# EAGLE design grab (EAGLE 6.6.0)

## Sheet 1 of 5
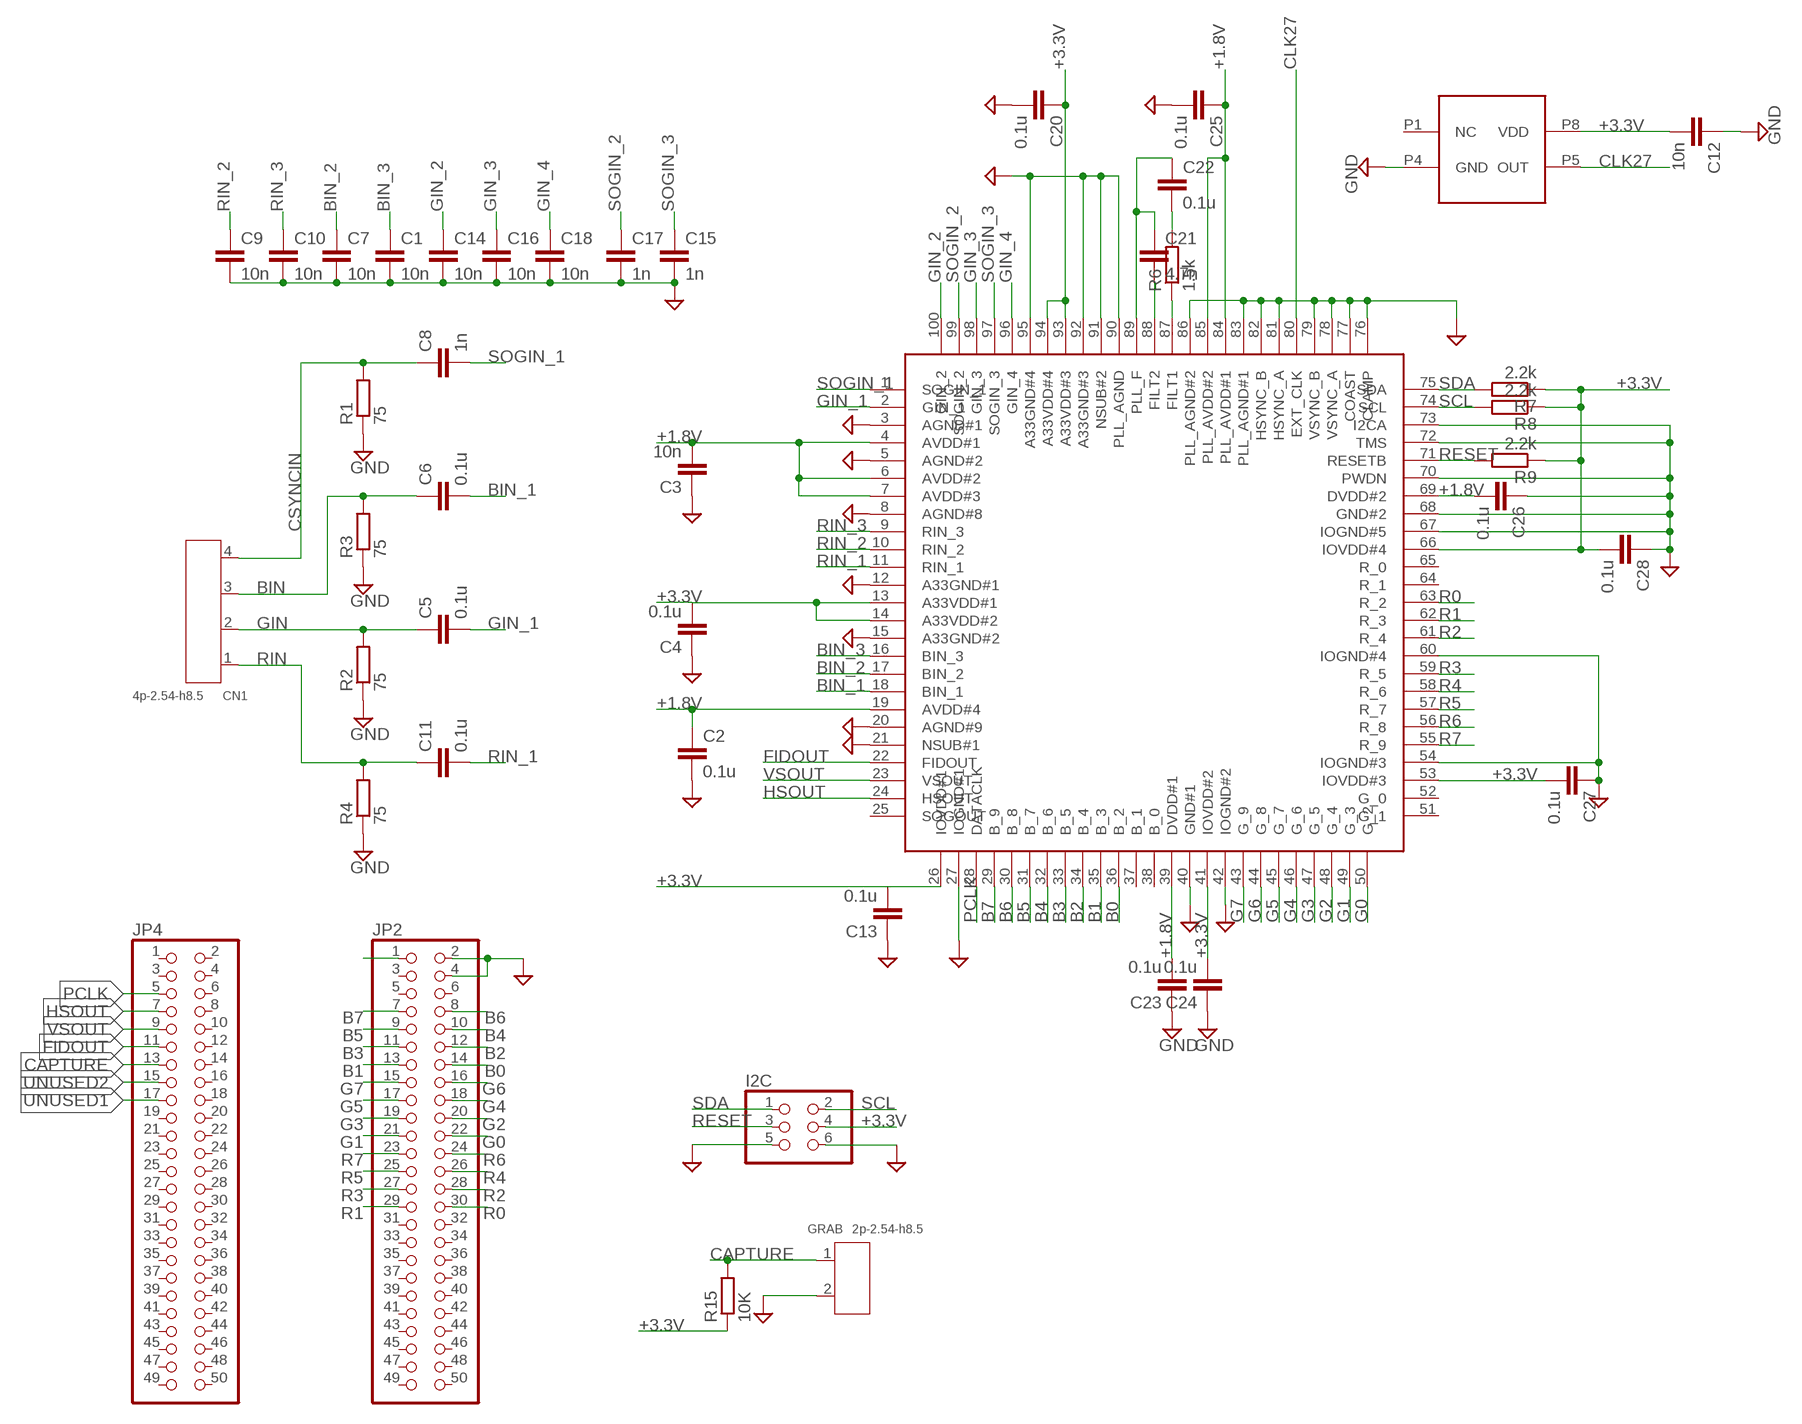
[diagram p0: schematic, sheet 1]

### Parts
27MHZ  ACHL-27MHZ-EK  [DIP4]
C1  10n  C-EUC0603  [C0603]
C2  0.1u  C-EUC0603  [C0603]
C3  10n  C-EUC0603  [C0603]
C4  0.1u  C-EUC0603  [C0603]
C5  0.1u  C-EUC0603  [C0603]
C6  0.1u  C-EUC0603  [C0603]
C7  10n  C-EUC0603  [C0603]
C8  1n  C-EUC0603  [C0603]
C9  10n  C-EUC0603  [C0603]
C10  10n  C-EUC0603  [C0603]
C11  0.1u  C-EUC0603  [C0603]
C12  10n  C-EUC0805  [C0805]
C13  0.1u  C-EUC0603  [C0603]
C14  10n  C-EUC0603  [C0603]
C15  1n  C-EUC0603  [C0603]
C16  10n  C-EUC0603  [C0603]
C17  1n  C-EUC0603  [C0603]
C18  10n  C-EUC0603  [C0603]
C20  0.1u  C-EUC0603  [C0603]
C21  4.7n  C-EUC0603  [C0603]
C22  0.1u  C-EUC0603  [C0603]
C23  0.1u  C-EUC0603  [C0603]
C24  0.1u  C-EUC0603  [C0603]
C25  0.1u  C-EUC0603  [C0603]
C26  0.1u  C-EUC0603  [C0603]
C27  0.1u  C-EUC0603  [C0603]
C28  0.1u  C-EUC0603  [C0603]
CN1  4p-2.54-h8.5  DIP-SCREW-TERMINAL-GREEN(4P-2.54-H8.5)  [H4-2.54-8.52X6.3MM]
GRAB  2p-2.54-h8.5  DIP-SCREW-TERMINAL-GREEN(2P-2.54-H8.5)  [H2-2.54-3.44X6.3MM]
I2C  PINHD-2X3  [2X03]
JP2  PINHD-2X25  [2X25]
JP4  PINHD-2X25  [2X25]
R1  75  R-EU_R0603  [R0603]
R2  75  R-EU_R0603  [R0603]
R3  75  R-EU_R0603  [R0603]
R4  75  R-EU_R0603  [R0603]
R6  1.5k  R-EU_R0603  [R0603]
R7  2.2k  R-EU_R0603  [R0603]
R8  2.2k  R-EU_R0603  [R0603]
R9  2.2k  R-EU_R0603  [R0603]
R15  10K  R-EU_R0603  [R0603]
TVP7002  TVP7002  [TQFP100]

### Nets
+1.8V: C2.1 C3.2 C23.2 C25.1 C26.2 TVP7002.4(AVDD#1) TVP7002.6(AVDD#2) TVP7002.7(AVDD#3) TVP7002.19(AVDD#4) TVP7002.39(DVDD#1) TVP7002.69(DVDD#2) TVP7002.84(PLL_AVDD#1) TVP7002.85(PLL_AVDD#2) ; also sheet 2
+3.3V: 27MHZ.P8(VDD) C4.2 C12.2 C13.2 C20.1 C24.2 C27.2 C28.2 I2C.4 R7.1 R8.1 R9.1 R15.1 TVP7002.13(A33VDD#1) TVP7002.14(A33VDD#2) TVP7002.26(IOVDD#1) TVP7002.41(IOVDD#2) TVP7002.53(IOVDD#3) TVP7002.66(IOVDD#4) TVP7002.93(A33VDD#3) TVP7002.94(A33VDD#4) ; also sheet 2
B0: JP2.14 TVP7002.36(B_2)
B1: JP2.13 TVP7002.35(B_3)
B2: JP2.12 TVP7002.34(B_4)
B3: JP2.11 TVP7002.33(B_5)
B4: JP2.10 TVP7002.32(B_6)
B5: JP2.9 TVP7002.31(B_7)
B6: JP2.8 TVP7002.30(B_8)
B7: JP2.7 TVP7002.29(B_9)
BIN: C6.1 CN1.3 R3.2
BIN_1: C6.2 TVP7002.18(BIN_1)
BIN_2: C7.1 TVP7002.17(BIN_2)
BIN_3: C1.1 TVP7002.16(BIN_3)
CAPTURE: GRAB.1 JP4.13 R15.2 ; also sheet 4
CLK27: 27MHZ.P5(OUT) TVP7002.80(EXT_CLK)
CSYNCIN: C8.1 CN1.4 R1.2
FIDOUT: JP4.11 TVP7002.22(FIDOUT)
G0: JP2.22 TVP7002.50(G_2)
G1: JP2.21 TVP7002.49(G_3)
G2: JP2.20 TVP7002.48(G_4)
G3: JP2.19 TVP7002.47(G_5)
G4: JP2.18 TVP7002.46(G_6)
G5: JP2.17 TVP7002.45(G_7)
G6: JP2.16 TVP7002.44(G_8)
G7: JP2.15 TVP7002.43(G_9)
GIN: C5.1 CN1.2 R2.2
GIN_1: C5.2 TVP7002.2(GIN_1)
GIN_2: C14.1 TVP7002.100(GIN_2)
GIN_3: C16.1 TVP7002.98(GIN_3)
GIN_4: C18.1 TVP7002.96(GIN_4)
GND: 27MHZ.P4(GND) C1.2 C2.2 C3.1 C4.1 C7.2 C9.2 C10.2 C12.1 C13.1 C14.2 C15.2 C16.2 C17.2 C18.2 C20.2 C23.1 C24.1 C25.2 C26.1 C27.1 C28.1 GRAB.2 I2C.5 I2C.6 JP2.2 JP2.4 R1.1 R2.1 R3.1 R4.1 TVP7002.3(AGND#1) TVP7002.5(AGND#2) TVP7002.8(AGND#8) TVP7002.12(A33GND#1) TVP7002.15(A33GND#2) TVP7002.20(AGND#9) TVP7002.21(NSUB#1) TVP7002.27(IOGND#1) TVP7002.40(GND#1) TVP7002.42(IOGND#2) TVP7002.54(IOGND#3) TVP7002.60(IOGND#4) TVP7002.67(IOGND#5) TVP7002.68(GND#2) TVP7002.70(PWDN) TVP7002.72(TMS) TVP7002.73(I2CA) TVP7002.76(CLAMP) TVP7002.77(COAST) TVP7002.78(VSYNC_A) TVP7002.79(VSYNC_B) TVP7002.81(HSYNC_A) TVP7002.82(HSYNC_B) TVP7002.83(PLL_AGND#1) TVP7002.86(PLL_AGND#2) TVP7002.90(PLL_AGND) TVP7002.91(NSUB#2) TVP7002.92(A33GND#3) TVP7002.95(A33GND#4) ; also sheet 2,3,4
HSOUT: JP4.7 TVP7002.24(HSOUT)
N$1: JP2.1
N$28: C21.2 TVP7002.88(FILT2)
N$29: R6.1 TVP7002.87(FILT1)
N$34: C22.2 R6.2
N$35: C21.1 C22.1 TVP7002.89(PLL_F)
PCLK: JP4.5 TVP7002.28(DATACLK)
R0: JP2.30 TVP7002.63(R_2)
R1: JP2.29 TVP7002.62(R_3)
R2: JP2.28 TVP7002.61(R_4)
R3: JP2.27 TVP7002.59(R_5)
R4: JP2.26 TVP7002.58(R_6)
R5: JP2.25 TVP7002.57(R_7)
R6: JP2.24 TVP7002.56(R_8)
R7: JP2.23 TVP7002.55(R_9)
RESET: I2C.3 R9.2 TVP7002.71(RESETB) ; also sheet 3
RIN: C11.1 CN1.1 R4.2
RIN_1: C11.2 TVP7002.11(RIN_1)
RIN_2: C9.1 TVP7002.10(RIN_2)
RIN_3: C10.1 TVP7002.9(RIN_3)
SCL: I2C.2 R8.2 TVP7002.74(SCL) ; also sheet 3
SDA: I2C.1 R7.2 TVP7002.75(SDA) ; also sheet 3
SOGIN_1: C8.2 TVP7002.1(SOGIN_1)
SOGIN_2: C17.1 TVP7002.99(SOGIN_2)
SOGIN_3: C15.1 TVP7002.97(SOGIN_3)
UNUSED1: JP4.17 ; also sheet 4
UNUSED2: JP4.15 ; also sheet 4
VSOUT: JP4.9 TVP7002.23(VSOUT)
Unconnected: 27MHZ.P1(NC) JP2.3 JP2.5 JP2.6 JP2.31 JP2.32 JP2.33 JP2.34 JP2.35 JP2.36 JP2.37 JP2.38 JP2.39 JP2.40 JP2.41 JP2.42 JP2.43 JP2.44 JP2.45 JP2.46 JP2.47 JP2.48 JP2.49 JP2.50 JP4.1 JP4.2 JP4.3 JP4.4 JP4.6 JP4.8 JP4.10 JP4.12 JP4.14 JP4.16 JP4.18 JP4.19 JP4.20 JP4.21 JP4.22 JP4.23 JP4.24 JP4.25 JP4.26 JP4.27 JP4.28 JP4.29 JP4.30 JP4.31 JP4.32 JP4.33 JP4.34 JP4.35 JP4.36 JP4.37 JP4.38 JP4.39 JP4.40 JP4.41 JP4.42 JP4.43 JP4.44 JP4.45 JP4.46 JP4.47 JP4.48 JP4.49 JP4.50 TVP7002.25(SOGOUT) TVP7002.37(B_1) TVP7002.38(B_0) TVP7002.51(G_1) TVP7002.52(G_0) TVP7002.64(R_1) TVP7002.65(R_0)

## Sheet 2 of 5
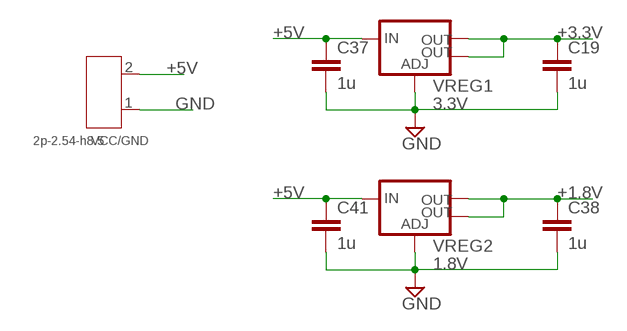
[diagram p1: schematic, sheet 2]

### Parts
C19  1u  C-EUC0603  [C0603]
C37  1u  C-EUC0603  [C0603]
C38  1u  C-EUC0603  [C0603]
C41  1u  C-EUC0603  [C0603]
VCC/GND  2p-2.54-h8.5  DIP-SCREW-TERMINAL-GREEN(2P-2.54-H8.5)  [H2-2.54-3.44X6.3MM]
VREG1  3.3V  V_REG_LM1117SOT223  [SOT223]
VREG2  1.8V  V_REG_LM1117SOT223  [SOT223]

### Nets
+1.8V: C38.1 VREG2.2(OUT) VREG2.4(OUT) ; also sheet 1
+3.3V: C19.1 VREG1.2(OUT) VREG1.4(OUT) ; also sheet 1
+5V: C37.1 C41.1 VCC/GND.2 VREG1.3(IN) VREG2.3(IN) ; also sheet 3,4
GND: C19.2 C37.2 C38.2 C41.2 VCC/GND.1 VREG1.1(ADJ) VREG2.1(ADJ) ; also sheet 1,3,4

## Sheet 3 of 5
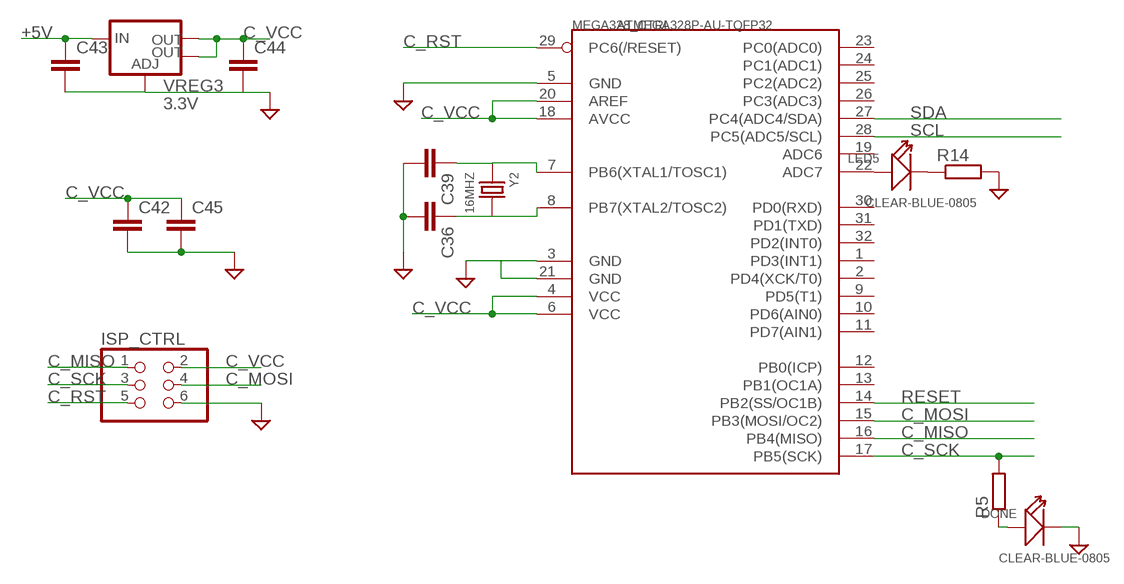
[diagram p2: schematic, sheet 3]

### Parts
C36  C-EUC0603  [C0603]
C39  C-EUC0603  [C0603]
C42  C-EUC0603  [C0603]
C43  C-EUC0603  [C0603]
C44  C-EUC0603  [C0603]
C45  C-EUC0603  [C0603]
DONE  CLEAR-BLUE-0805  SMD-LED-CLEAR-BLUE(0805)  [LED-0805]
ISP_CTRL  PINHD-2X3  [2X03]
LED5  CLEAR-BLUE-0805  SMD-LED-CLEAR-BLUE(0805)  [LED-0805]
MEGA328_CTRL  ATMEGA328P-AU-TQFP32  MCU-ATMEGA328P-AU(TQFP32)  [TQFP32-0.8-7X7MM]
R5  R-EU_R0603  [R0603]
R14  R-EU_R0603  [R0603]
VREG3  3.3V  V_REG_LM1117SOT223  [SOT223]
Y2  16MHZ  SMD-CRYSTAL-16MHZ-8PF-20PPM-40R(2P-5.0X3.2MM)  [X2-SMD-5.0X3.2X1.3MM]

### Nets
+5V: C43.1 VREG3.3(IN) ; also sheet 2,4
C_MISO: ISP_CTRL.1 MEGA328_CTRL.16(PB4(MISO))
C_MOSI: ISP_CTRL.4 MEGA328_CTRL.15(PB3(MOSI/OC2))
C_RST: ISP_CTRL.5 MEGA328_CTRL.29(PC6(/RESET))
C_SCK: ISP_CTRL.3 MEGA328_CTRL.17(PB5(SCK)) R5.2
C_VCC: C42.1 C44.1 C45.1 ISP_CTRL.2 MEGA328_CTRL.4(VCC) MEGA328_CTRL.6(VCC) MEGA328_CTRL.18(AVCC) MEGA328_CTRL.20(AREF) VREG3.2(OUT) VREG3.4(OUT)
GND: C36.2 C39.2 C42.2 C43.2 C44.2 C45.2 DONE.- ISP_CTRL.6 MEGA328_CTRL.3(GND) MEGA328_CTRL.5(GND) MEGA328_CTRL.21(GND) R14.2 VREG3.1(ADJ) ; also sheet 1,2,4
N$4: C39.1 MEGA328_CTRL.7(PB6(XTAL1/TOSC1)) Y2.1
N$5: C36.1 MEGA328_CTRL.8(PB7(XTAL2/TOSC2)) Y2.2
N$8: DONE.+ R5.1
N$16: LED5.+ MEGA328_CTRL.22(ADC7)
N$17: LED5.- R14.1
RESET: MEGA328_CTRL.14(PB2(SS/OC1B)) ; also sheet 1
SCL: MEGA328_CTRL.28(PC5(ADC5/SCL)) ; also sheet 1
SDA: MEGA328_CTRL.27(PC4(ADC4/SDA)) ; also sheet 1
Unconnected: MEGA328_CTRL.1(PD3(INT1)) MEGA328_CTRL.2(PD4(XCK/T0)) MEGA328_CTRL.9(PD5(T1)) MEGA328_CTRL.10(PD6(AIN0)) MEGA328_CTRL.11(PD7(AIN1)) MEGA328_CTRL.12(PB0(ICP)) MEGA328_CTRL.13(PB1(OC1A)) MEGA328_CTRL.19(ADC6) MEGA328_CTRL.23(PC0(ADC0)) MEGA328_CTRL.24(PC1(ADC1)) MEGA328_CTRL.25(PC2(ADC2)) MEGA328_CTRL.26(PC3(ADC3)) MEGA328_CTRL.30(PD0(RXD)) MEGA328_CTRL.31(PD1(TXD)) MEGA328_CTRL.32(PD2(INT0))

## Sheet 4 of 5
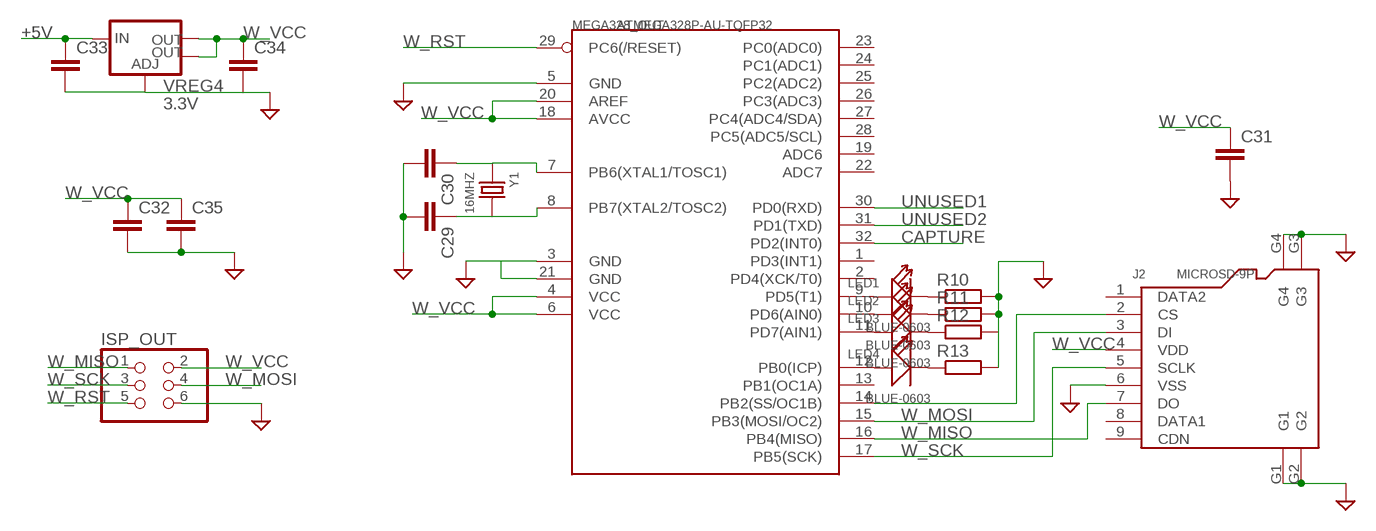
[diagram p3: schematic, sheet 4]

### Parts
C29  C-EUC0603  [C0603]
C30  C-EUC0603  [C0603]
C31  C-EUC0603  [C0603]
C32  C-EUC0603  [C0603]
C33  C-EUC0603  [C0603]
C34  C-EUC0603  [C0603]
C35  C-EUC0603  [C0603]
ISP_OUT  PINHD-2X3  [2X03]
J2  MICROSD-9P  MICRO-SD-CARD-HOLDER-9P  [MICRO-SD9+4P-SMD-16.1X14.5X1.85MM]
LED1  BLUE-0603  SMD-LED-CLEAR-BLUE(0603)  [LED-0603]
LED2  BLUE-0603  SMD-LED-CLEAR-BLUE(0603)  [LED-0603]
LED3  BLUE-0603  SMD-LED-CLEAR-BLUE(0603)  [LED-0603]
LED4  BLUE-0603  SMD-LED-CLEAR-BLUE(0603)  [LED-0603]
MEGA328_OUT  ATMEGA328P-AU-TQFP32  MCU-ATMEGA328P-AU(TQFP32)  [TQFP32-0.8-7X7MM]
R10  R-EU_R0603  [R0603]
R11  R-EU_R0603  [R0603]
R12  R-EU_R0603  [R0603]
R13  R-EU_R0603  [R0603]
VREG4  3.3V  V_REG_LM1117SOT223  [SOT223]
Y1  16MHZ  SMD-CRYSTAL-16MHZ-8PF-20PPM-40R(2P-5.0X3.2MM)  [X2-SMD-5.0X3.2X1.3MM]

### Nets
+5V: C33.1 VREG4.3(IN) ; also sheet 2,3
CAPTURE: MEGA328_OUT.32(PD2(INT0)) ; also sheet 1
GND: C29.2 C30.2 C31.2 C32.2 C33.2 C34.2 C35.2 ISP_OUT.6 J2.6(VSS) J2.G1 J2.G2 J2.G3 J2.G4 MEGA328_OUT.3(GND) MEGA328_OUT.5(GND) MEGA328_OUT.21(GND) R10.2 R11.2 R13.2 VREG4.1(ADJ) ; also sheet 1,2,3
N$2: J2.2(CS) MEGA328_OUT.14(PB2(SS/OC1B))
N$3: LED1.+ MEGA328_OUT.9(PD5(T1))
N$6: LED2.+ MEGA328_OUT.10(PD6(AIN0))
N$7: LED3.+ MEGA328_OUT.11(PD7(AIN1))
N$9: LED4.+ MEGA328_OUT.12(PB0(ICP))
N$10: C30.1 MEGA328_OUT.7(PB6(XTAL1/TOSC1)) Y1.1
N$11: C29.1 MEGA328_OUT.8(PB7(XTAL2/TOSC2)) Y1.2
N$12: LED1.- R10.1
N$13: LED2.- R11.1
N$14: LED3.- R12.1
N$15: LED4.- R13.1
UNUSED1: MEGA328_OUT.30(PD0(RXD)) ; also sheet 1
UNUSED2: MEGA328_OUT.31(PD1(TXD)) ; also sheet 1
W_MISO: ISP_OUT.1 J2.7(DO) MEGA328_OUT.16(PB4(MISO))
W_MOSI: ISP_OUT.4 J2.3(DI) MEGA328_OUT.15(PB3(MOSI/OC2))
W_RST: ISP_OUT.5 MEGA328_OUT.29(PC6(/RESET))
W_SCK: ISP_OUT.3 J2.5(SCLK) MEGA328_OUT.17(PB5(SCK))
W_VCC: C31.1 C32.1 C34.1 C35.1 ISP_OUT.2 J2.4(VDD) MEGA328_OUT.4(VCC) MEGA328_OUT.6(VCC) MEGA328_OUT.18(AVCC) MEGA328_OUT.20(AREF) VREG4.2(OUT) VREG4.4(OUT)
Unconnected: J2.1(DATA2) J2.8(DATA1) J2.9(CDN) MEGA328_OUT.1(PD3(INT1)) MEGA328_OUT.2(PD4(XCK/T0)) MEGA328_OUT.13(PB1(OC1A)) MEGA328_OUT.19(ADC6) MEGA328_OUT.22(ADC7) MEGA328_OUT.23(PC0(ADC0)) MEGA328_OUT.24(PC1(ADC1)) MEGA328_OUT.25(PC2(ADC2)) MEGA328_OUT.26(PC3(ADC3)) MEGA328_OUT.27(PC4(ADC4/SDA)) MEGA328_OUT.28(PC5(ADC5/SCL)) R12.2

## Sheet 5 of 5

## Library data of the parts
27MHZ = buffiscreengrab:ACHL-27MHZ-EK
C1-C11 C13-C39 C41-C45 = resistor:C-EU: CAPACITOR, European symbol
C12 = rcl:C-EU: CAPACITOR, European symbol
CN1 = Seeed-OPL-Connector:DIP-SCREW-TERMINAL-GREEN(4P-2.54-H8.5): 320110118; MPN: GS019-2.54-4P-1
DONE LED5 = Seeed-OPL-Diode:SMD-LED-CLEAR-BLUE(0805): 304090061; MPN: EL-17-215/BHC-AN1P2/3T
GRAB VCC/GND = Seeed-OPL-Connector:DIP-SCREW-TERMINAL-GREEN(2P-2.54-H8.5): 320110130; MPN: GS019-2.54-2P-1
I2C ISP_CTRL ISP_OUT = pinhead:PINHD-2X3: PIN HEADER
J2 = Seeed-OPL-Connector:MICRO-SD-CARD-HOLDER-9P: 320090008
JP2 JP4 = pinhead:PINHD-2X25: PIN HEADER
LED1-LED4 = Seeed-OPL-Diode:SMD-LED-CLEAR-BLUE(0603): 304090045; MPN: 19-217-BHC-ZL1M2RY-3T
MEGA328_CTRL MEGA328_OUT = Seeed-OPL-ic:MCU-ATMEGA328P-AU(TQFP32): 310010049; MPN: ATMEGA328P-AU
R1-R15 = resistor:R-EU_: RESISTOR, European symbol
TVP7002 = buffiscreengrab:TVP7002
VREG1-VREG4 = SparkFun-PowerIC:V_REG_LM1117: Voltage Regulator LM1117 Standard adjustable voltage regulator but in SMD form. Spark Fun Electronics SKU : COM-00595; PROD_ID: VREG-08170
Y1 Y2 = Seeed-OPL-crystal-osctllator:SMD-CRYSTAL-16MHZ-8PF-20PPM-40R(2P-5.0X3.2MM): 306010054; MPN: X053201602002

## Board
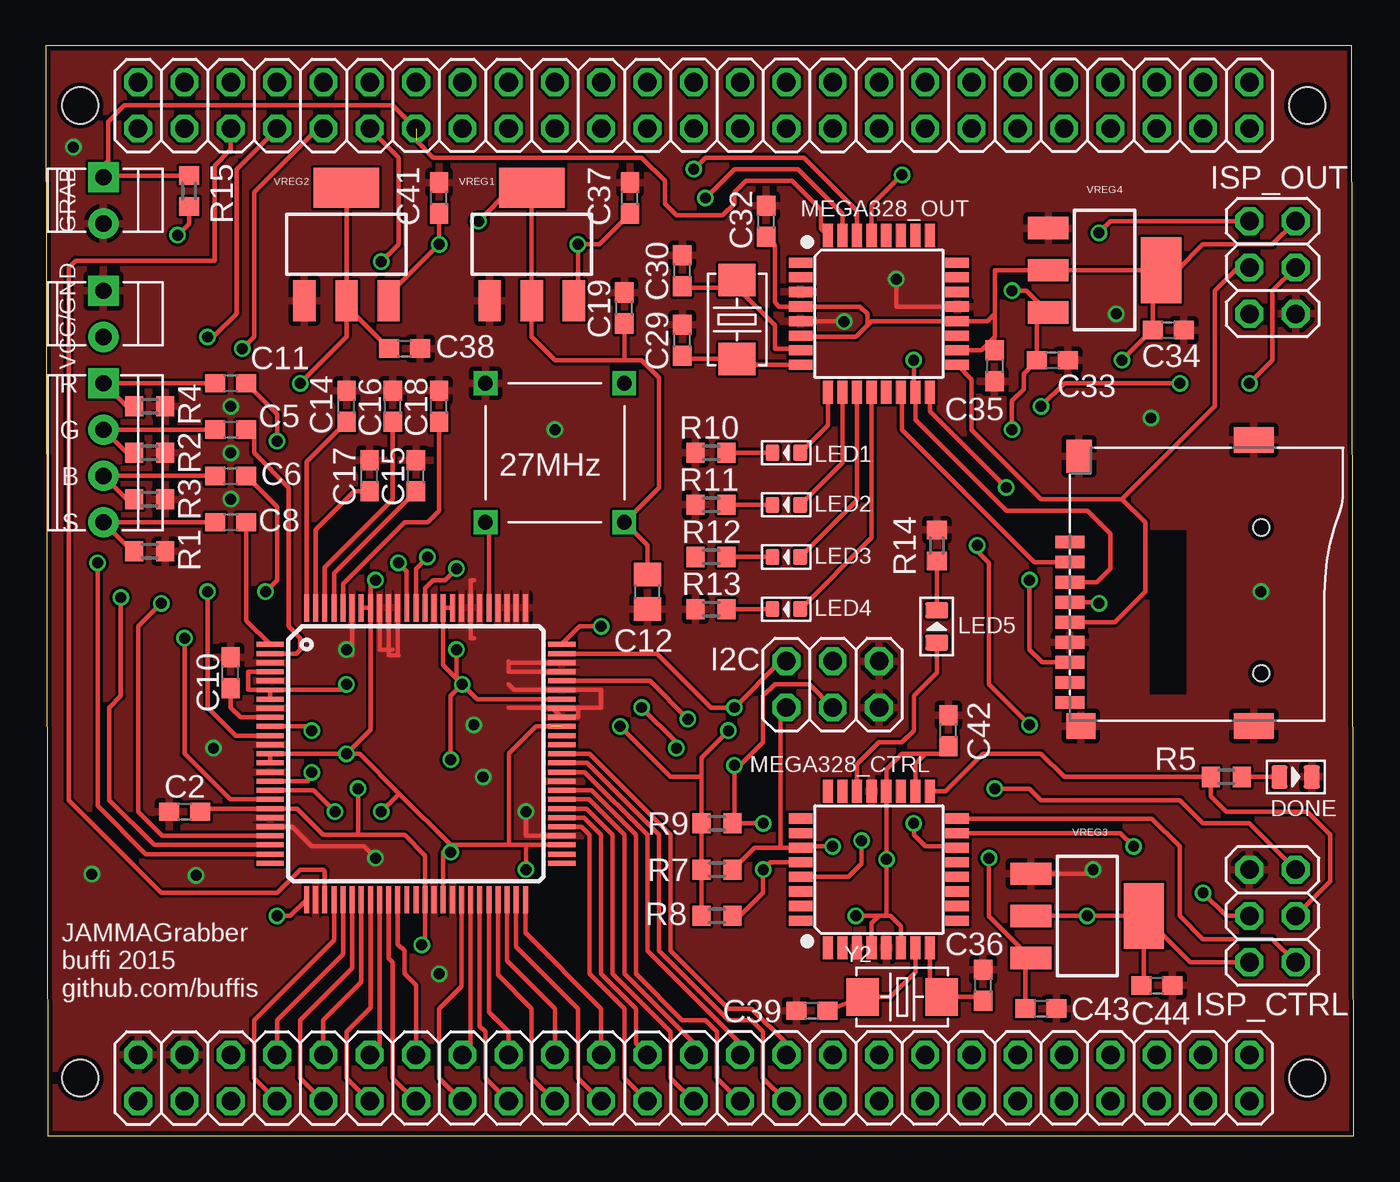
[diagram p4: board, top side]
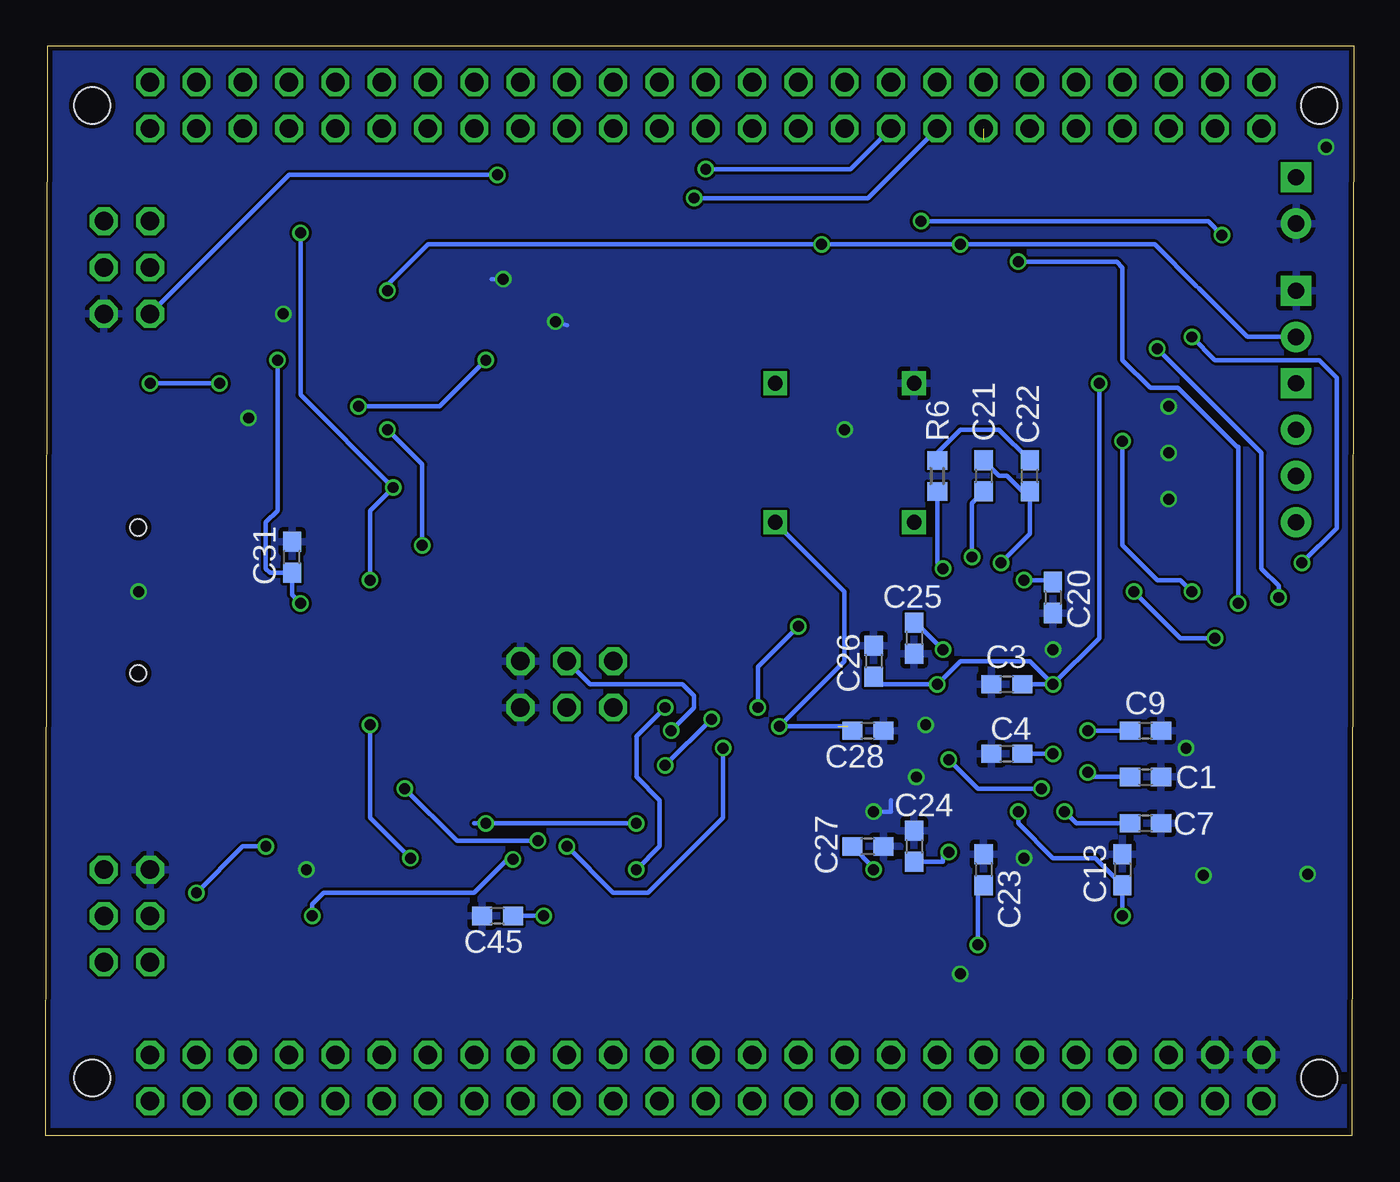
[diagram p5: board, bottom side, seen from below]

Size 71.78 x 59.79 mm. Coordinates in mm from the lower left corner, seen from the top.
Outline: 0.13,0 71.78,0 71.65,59.79 0,59.79 0.13,0
Copper layers (1*16): Top 0.035mm / dielectric 1.5mm / Bottom 0.035mm
Design rules "SeeedStudio_2layer_DRU_no_angle_20140221": minimum track width 6mil, minimum drill 12mil, track to track 6mil, track to pad 6mil, pad to pad 6mil, via to via 6mil, smd to smd 0mil, copper to edge 10mil, drill to drill 10mil, minimum pad ring 10mil, minimum via ring 6mil, stop-mask expansion 2mil, vias tented up to drill 100mil, thermal gap 10mil
Holes 2 mm at 1.91,3.17 69.22,3.17 1.91,56.52 69.22,56.52

### Footprints (pad centres in the part's own frame; a part is rotated, then mirrored left to right if it is on the bottom)
DIP4 = drill 0.8 square: P1 -3.81,-3.81; P4 3.81,-3.81; P5 3.81,3.81; P8 -3.81,3.81
C0603 = smd 1.1 x 1: 1 -0.85,0; 2 0.85,0
C0805 = smd 1.3 x 1.5: 1 -0.95,0; 2 0.95,0
H4-2.54-8.52X6.3MM = drill 0.889 pad 1.651 square: 1 0,3.81 | drill 0.889 pad 1.651: 2 0,1.27; 3 0,-1.27; 4 0,-3.81
LED-0805 = smd 0.889 x 1.27: + -0.889,0; - 0.889,0
H2-2.54-3.44X6.3MM = drill 0.889 pad 1.651 square: 1 0,1.27 | drill 0.889 pad 1.651: 2 0,-1.27
2X03 = drill 1.016 octagon: 1 -2.54,-1.27; 2 -2.54,1.27; 3 0,-1.27; 4 0,1.27; 5 2.54,-1.27; 6 2.54,1.27
MICRO-SD9+4P-SMD-16.1X14.5X1.85MM = smd 1.6 x 0.7: 1 0,2.25; 2 0,1.15; 3 0,0.05; 4 0,-1.05; 5 0,-2.15; 6 0,-3.25; 7 0,-4.35; 8 0,-5.45; 9 0,-6.55 | smd 1.6 x 1.4: G1 0.6,-7.85 | smd 2.2 x 1.4: G2 10.1,-7.85; G3 10.1,7.85 | smd 1.4 x 1.8: G4 0.5,6.95 | hole 0.9: 10.5,-4.95; 10.5,3.05
2X25 = drill 1.016 octagon: 1 -30.48,-1.27; 2 -30.48,1.27; 3 -27.94,-1.27; 4 -27.94,1.27; 5 -25.4,-1.27; 6 -25.4,1.27; 7 -22.86,-1.27; 8 -22.86,1.27; 9 -20.32,-1.27; 10 -20.32,1.27; 11 -17.78,-1.27; 12 -17.78,1.27; 13 -15.24,-1.27; 14 -15.24,1.27; 15 -12.7,-1.27; 16 -12.7,1.27; 17 -10.16,-1.27; 18 -10.16,1.27; 19 -7.62,-1.27; 20 -7.62,1.27; 21 -5.08,-1.27; 22 -5.08,1.27; 23 -2.54,-1.27; 24 -2.54,1.27; 25 0,-1.27; 26 0,1.27; 27 2.54,-1.27; 28 2.54,1.27; 29 5.08,-1.27; 30 5.08,1.27; 31 7.62,-1.27; 32 7.62,1.27; 33 10.16,-1.27; 34 10.16,1.27; 35 12.7,-1.27; 36 12.7,1.27; 37 15.24,-1.27; 38 15.24,1.27; 39 17.78,-1.27; 40 17.78,1.27; 41 20.32,-1.27; 42 20.32,1.27; 43 22.86,-1.27; 44 22.86,1.27; 45 25.4,-1.27; 46 25.4,1.27; 47 27.94,-1.27; 48 27.94,1.27; 49 30.48,-1.27; 50 30.48,1.27
LED-0603 = smd 0.762 x 0.889: + -0.762,0; - 0.762,0
TQFP32-0.8-7X7MM = smd 1.27 x 0.559: 1 -4.293,2.8; 2 -4.293,2; 3 -4.293,1.2; 4 -4.293,0.4; 5 -4.293,-0.4; 6 -4.293,-1.2; 7 -4.293,-2; 8 -4.293,-2.8; 17 4.293,-2.8; 18 4.293,-2; 19 4.293,-1.2; 20 4.293,-0.4; 21 4.293,0.4; 22 4.293,1.2; 23 4.293,2; 24 4.293,2.8 | smd 0.559 x 1.27: 9 -2.8,-4.293; 10 -2,-4.293; 11 -1.2,-4.293; 12 -0.4,-4.293; 13 0.4,-4.293; 14 1.2,-4.293; 15 2,-4.293; 16 2.8,-4.293; 25 2.8,4.293; 26 2,4.293; 27 1.2,4.293; 28 0.4,4.293; 29 -0.4,4.293; 30 -1.2,4.293; 31 -2,4.293; 32 -2.8,4.293
R0603 = smd 1 x 1.1: 1 -0.85,0; 2 0.85,0
TQFP100 = smd 1.5 x 0.274: 1 -8,6; 2 -8,5.5; 3 -8,5; 4 -8,4.5; 5 -8,4; 6 -8,3.5; 7 -8,3; 8 -8,2.5; 9 -8,2; 10 -8,1.5; 11 -8,1; 12 -8,0.5; 13 -8,0; 14 -8,-0.5; 15 -8,-1; 16 -8,-1.5; 17 -8,-2; 18 -8,-2.5; 19 -8,-3; 20 -8,-3.5; 21 -8,-4; 22 -8,-4.5; 23 -8,-5; 24 -8,-5.5; 25 -8,-6; 51 8,-6; 52 8,-5.5; 53 8,-5; 54 8,-4.5; 55 8,-4; 56 8,-3.5; 57 8,-3; 58 8,-2.5; 59 8,-2; 60 8,-1.5; 61 8,-1; 62 8,-0.5; 63 8,0; 64 8,0.5; 65 8,1; 66 8,1.5; 67 8,2; 68 8,2.5; 69 8,3; 70 8,3.5; 71 8,4; 72 8,4.5; 73 8,5; 74 8,5.5; 75 8,6 | smd 0.274 x 1.5: 26 -6,-8; 27 -5.5,-8; 28 -5,-8; 29 -4.5,-8; 30 -4,-8; 31 -3.5,-8; 32 -3,-8; 33 -2.5,-8; 34 -2,-8; 35 -1.5,-8; 36 -1,-8; 37 -0.5,-8; 38 0,-8; 39 0.5,-8; 40 1,-8; 41 1.5,-8; 42 2,-8; 43 2.5,-8; 44 3,-8; 45 3.5,-8; 46 4,-8; 47 4.5,-8; 48 5,-8; 49 5.5,-8; 50 6,-8; 76 6,8; 77 5.5,8; 78 5,8; 79 4.5,8; 80 4,8; 81 3.5,8; 82 3,8; 83 2.5,8; 84 2,8; 85 1.5,8; 86 1,8; 87 0.5,8; 88 0,8; 89 -0.5,8; 90 -1,8; 91 -1.5,8; 92 -2,8; 93 -2.5,8; 94 -3,8; 95 -3.5,8; 96 -4,8; 97 -4.5,8; 98 -5,8; 99 -5.5,8; 100 -6,8
SOT223 = smd 1.219 x 2.235: 1 -2.311,-3.099; 2 0,-3.099; 3 2.311,-3.099 | smd 3.6 x 2.2: 4 0,3.099
X2-SMD-5.0X3.2X1.3MM = smd 1.778 x 2.032: 1 -2.159,0; 2 2.159,0

### Placement (x,y rotation side)
27MHZ  27.94,37.46 180 top
C1  11.43,19.69 0 bottom
C2  7.62,17.78 180 top
C3  19.05,24.77 0 bottom
C4  19.05,20.96 0 bottom
C5  10.16,38.73 0 top
C6  10.16,36.2 0 top
C7  11.43,17.15 0 bottom
C8  10.16,33.66 0 top
C9  11.43,22.23 0 bottom
C10  10.16,25.4 90 top
C11  10.16,41.27 0 top
C12  33.02,29.85 90 top
C13  12.7,14.61 270 bottom
C14  16.51,40 90 top
C15  20.32,36.2 90 top
C16  19.05,40 90 top
C17  17.78,36.2 90 top
C18  21.59,40 90 top
C19  31.75,45.4 90 top
C20  16.51,29.53 270 bottom
C21  20.32,36.2 270 bottom
C22  17.78,36.2 90 bottom
C23  20.32,14.61 270 bottom
C24  24.13,15.88 270 bottom
C25  24.13,27.31 270 bottom
C26  26.35,26.04 270 bottom
C27  26.67,15.88 180 bottom
C28  26.67,22.23 180 bottom
C29  34.93,43.64 90 top
C30  34.93,47.45 90 top
C31  58.26,31.74 90 bottom
C32  39.53,50.16 90 top
C33  55.24,42.54 0 top
C34  61.59,44.2 0 top
C35  52.06,42.23 270 top
C36  51.44,8.26 90 top
C37  32.07,51.43 90 top
C38  19.68,43.18 0 top
C39  42.04,6.86 180 top
C41  21.59,51.43 90 top
C42  49.53,22.23 90 top
C43  54.61,6.98 0 top
C44  60.96,8.26 0 top
C45  46.99,12.06 180 bottom
CN1  3.17,37.46 0 top
DONE  68.58,19.69 0 top
GRAB  3.17,51.31 0 top
I2C  43.18,24.77 0 top
ISP_CTRL  67.31,12.06 90 top
ISP_OUT  67.31,47.62 270 top
J2  56.19,30.32 0 top
JP2  35.56,3.17 0 top
JP4  35.56,56.52 0 top
LED1  40.64,37.46 180 top
LED2  40.64,34.61 180 top
LED3  40.64,31.75 180 top
LED4  40.64,28.89 180 top
LED5  48.9,27.94 90 top
MEGA328_CTRL  45.72,14.61 90 top
MEGA328_OUT  45.72,45.09 0 top
R1  5.71,32.07 180 top
R2  5.71,37.46 180 top
R3  5.71,34.92 180 top
R4  5.71,40 180 top
R5  64.77,19.69 180 top
R6  22.86,36.2 90 bottom
R7  36.83,14.61 0 top
R8  36.83,12.06 0 top
R9  36.83,17.15 0 top
R10  36.51,37.46 180 top
R11  36.51,34.61 180 top
R12  36.51,31.75 180 top
R13  36.51,28.89 180 top
R14  48.9,32.38 90 top
R15  7.87,51.82 90 top
TVP7002  20.32,20.96 0 top
VCC/GND  3.17,45.09 0 top
VREG1  26.67,48.89 0 top
VREG2  16.51,48.89 0 top
VREG3  57.15,12.06 270 top
VREG4  58.1,47.48 270 top
Y1  37.94,44.77 270 top
Y2  46.99,7.62 0 top

### Tracks (layer width: path | path; a pad name or v marks a point on that pad's centre or on a via)
+1.8V  (via drill 0.6)
  Top 0.254: TVP7002.84 TVP7002.85 21.82,25.81 v22.86,24.77 | TVP7002.6 TVP7002.7 | TVP7002.6 11.11,24.46 11.11,25.46 TVP7002.4 | v20.64,10.48 20.82,10.66 TVP7002.39 20.82,15.38 19.68,16.51 17.14,16.51 | C2.1 8.64,17.96 TVP7002.19 13.79,17.96 15.24,16.51 17.14,16.51 | TVP7002.6 16.2,24.46 v16.51,24.77 | TVP7002.69 23.67,23.96 v22.86,24.77 | v22.54,26.67 22.54,25.08 v22.86,24.77 | VREG2.4 VREG2.2 16.51,45.09 | 16.51,45.09 16.51,43.81 v13.97,41.27 | C38.1 16.93,45.09 16.51,45.09 | 17.14,16.51 v17.14,19.05 | v22.23,20.64 22.23,24.13 v22.86,24.77
  Bottom 0.254: v20.64,10.48 20.64,13.44 C23.2 | v16.51,24.77 C3.2 | v16.51,24.77 17.78,26.04 21.59,26.04 v22.86,24.77 25.93,24.77 C26.2 | C25.1 24.03,28.16 v22.54,26.67 | v13.97,41.27 13.97,27.31 v16.51,24.77 | v17.14,19.05 20.64,19.05 v22.23,20.64
+3.3V  (via drill 0.6)  (1 unrouted)
  Top 0.254: TVP7002.14 TVP7002.13 v16.51,20.96 | TVP7002.26 13.43,12.06 v12.7,12.06 | TVP7002.41 21.82,15.56 | 21.82,15.56 v22.23,15.56 | 21.82,15.56 22.22,15.96 | 22.22,15.96 25.44,15.96 | 25.44,15.96 26.35,15.96 | 26.35,15.96 TVP7002.53 | 22.22,15.96 19.4,18.77 | 19.4,18.77 17.22,20.96 v16.51,20.96 | TVP7002.93 17.82,22.27 v16.51,20.96 | v18.41,17.78 19.4,18.77 | R8.1 R7.1 R9.1 35.98,19.69 | v31.52,22.46 34.29,19.69 35.98,19.69 | 25.44,15.96 25.44,20.99 26.9,22.46 TVP7002.66 | 31.75,42.54 27.94,42.54 26.67,43.81 VREG1.2 VREG1.4 25.58,51.99 v23.75,50.16 | 31.75,42.54 32.7,42.54 33.66,41.59 33.66,35.56 27MHZ.P8 33.02,32.38 C12.2 | C19.1 31.75,42.54 | v26.35,14.61 26.35,15.96 | TVP7002.93 17.82,30.2 v18.1,30.48 | TVP7002.94 TVP7002.93 | 35.98,19.69 35.98,20.74 v37.47,22.23 | R15.1 7.87,50.04 v7.24,49.4
  Bottom 0.254: v12.7,12.06 C13.2 14.19,15.24 16.51,15.24 18.41,17.15 v18.41,17.78 | v22.23,15.56 22.54,15.56 22.54,15.03 C24.2 | v16.51,20.96 C4.2 | C28.2 27.75,22.46 v31.52,22.46 27.94,26.04 27.94,29.85 27MHZ.P8 | C27.2 26.35,14.71 v26.35,14.61 | v18.1,30.48 16.61,30.48 C20.1 | v37.47,22.23 36.2,23.5 36.2,24.13 36.83,24.77 41.91,24.77 I2C.4 | v23.75,50.16 8,50.16 v7.24,49.4
+5V  (via drill 0.6)
  Top 0.254: C43.1 53.76,9.46 VREG3.3 51.75,12.05 v51.75,15.24 | VREG2.3 18.82,46.13 v21.59,48.89 C41.1 | VREG1.3 29.21,45.8 v29.21,48.89 30.38,48.89 C37.1 | v53.02,46.35 53.81,46.35 VREG4.3 54.4,44.56 C33.1 53.66,41.81 53.66,40.96 53.02,40.32 v53.02,38.73 | v53.98,22.54 51.75,24.77 51.75,31.43 51.12,32.07 v51.12,32.38
  Bottom 0.254: v53.02,46.35 53.02,46.67 50.8,48.89 v29.21,48.89 v21.59,48.89 10.92,48.89 8.64,46.61 8.51,46.48 5.84,43.81 VCC/GND.2 | v51.75,15.24 53.98,17.46 v53.98,22.54 | v51.12,32.38 51.12,36.83 v53.02,38.73
B0
  Top 0.254: JP2.14 20.32,8.26 19.68,8.89 19.68,10.16 19.32,10.53 TVP7002.36
B1
  Top 0.254: JP2.13 19.05,3.17 19.05,9.53 18.82,9.75 TVP7002.35
B2
  Top 0.254: JP2.12 18.32,4.98 TVP7002.34
B3
  Top 0.254: JP2.11 16.51,3.17 16.51,5.71 17.82,7.02 TVP7002.33
B4
  Top 0.254: JP2.10 15.24,6.35 17.32,8.43 TVP7002.32
B5
  Top 0.254: JP2.9 13.97,3.17 13.97,6.35 16.82,9.2 TVP7002.31
B6
  Top 0.254: JP2.8 12.7,6.35 16.32,9.97 TVP7002.30
B7
  Top 0.254: JP2.7 11.43,3.17 11.43,6.35 15.82,10.74 TVP7002.29
BIN
  Top 0.254: C6.1 CN1.3 4.45,34.92 R3.2
BIN_1  (via drill 0.6)
  Top 0.254: C6.2 12.7,34.5 12.7,30.48 v12.06,29.85 | v7.62,27.31 7.62,20.96 10.12,18.46 TVP7002.18
  Bottom 0.254: v12.06,29.85 9.53,27.31 v7.62,27.31
BIN_2  (via drill 0.6)
  Top 0.254: TVP7002.17 14.7,18.96 v15.88,17.78
  Bottom 0.254: C7.1 15.24,17.15 v15.88,17.78
BIN_3  (via drill 0.6)
  Top 0.254: TVP7002.16 14.38,19.46 v14.61,19.94
  Bottom 0.254: C1.1 14.35,19.69 v14.61,19.94
C_MISO
  Top 0.254: ISP_CTRL.1 67.31,10.79 63.5,10.79 62.23,12.06 62.23,15.88 60.7,17.41 MEGA328_CTRL.16
C_MOSI  (via drill 0.6)
  Top 0.254: ISP_CTRL.4 64.77,12.06 v63.5,13.33 | v59.69,15.88 58.96,16.61 MEGA328_CTRL.15
  Bottom 0.254: v63.5,13.33 60.96,15.88 v59.69,15.88
C_RST  (via drill 0.6)
  Top 0.254: ISP_CTRL.5 66.04,17.15 63.5,17.15 62.23,18.42 54.61,18.42 53.98,19.05 v52.07,19.05 | MEGA328_CTRL.29 44.05,14.21 44.77,14.92 v44.77,16.19
  Bottom 0.254: v52.07,19.05 49.21,16.19 v44.77,16.19
C_SCK
  Top 0.254: ISP_CTRL.3 70.48,13.97 70.48,16.51 69.22,17.78 64.77,17.78 63.92,18.63 R5.2 55.88,19.69 54.61,20.96 51.44,20.96 49.38,18.9 MEGA328_CTRL.17
C_VCC  (via drill 0.6)
  Top 0.254: C44.1 60.25,8.39 VREG3.4 | VREG3.4 v57.15,12.06 VREG3.2 | ISP_CTRL.2 62.79,9.53 VREG3.4 | MEGA328_CTRL.4 45.32,11.66 45.72,12.06 | 45.72,12.06 C45.1 | C45.1 46.35,12.06 46.92,11.5 MEGA328_CTRL.6 | 45.72,12.06 v44.45,12.06 | MEGA328_CTRL.20 46.14,18.88 | 46.14,18.88 v46.14,15.17 C45.1 | MEGA328_CTRL.18 47.72,20.42 48.26,20.96 | 48.26,20.96 49.11,20.96 C42.1 | 46.14,18.88 46.14,20.11 46.99,20.96 48.26,20.96
  Bottom 0.254: v44.45,12.06 C45.1 | v46.14,15.17 46.42,15.17 48.26,13.33 56.52,13.33 57.15,12.7 v57.15,12.06
CAPTURE  (1 unrouted)
  Top 0.254: 20.32,54.61 21.27,53.66 32.7,53.66 33.97,52.39 33.97,51.12 34.61,50.48 37.15,50.48 37.78,51.12 37.78,51.75 38.42,52.39 40.96,52.39 42.55,50.8 42.55,49.75 MEGA328_OUT.32 | JP4.13 19.05,56.52 4.32,56.52 3.43,55.63 3.43,53.47 3.17,53.21 GRAB.1 3.26,52.67 R15.2
CLK27
  Top 0.254: 27MHZ.P5 24.32,33.46 TVP7002.80
CSYNCIN
  Top 0.254: C8.1 CN1.4 4.76,32.07 R1.2
FIDOUT  (via drill 0.6)
  Top 0.254: TVP7002.22 6.41,16.46 5.08,17.78 5.08,27.94 v6.35,29.21 | v18.41,47.94 19.37,48.89 19.37,53.66 JP4.11
  Bottom 0.254: v6.35,29.21 6.35,37.78 6.41,37.78 9.65,41.02 11.18,41.02 12.7,42.54 12.7,47.62 13.02,47.94 v18.41,47.94
G0
  Top 0.254: JP2.22 30.48,6.98 26.32,11.14 TVP7002.50
G1
  Top 0.254: JP2.21 29.21,3.17 29.21,6.98 25.82,10.38 TVP7002.49
G2
  Top 0.254: JP2.20 27.94,6.98 25.32,9.61 TVP7002.48
G3
  Top 0.254: JP2.19 26.67,3.17 26.67,6.98 24.82,8.83 TVP7002.47
G4
  Top 0.254: JP2.18 25.4,5.71 24.32,6.79 TVP7002.46
G5
  Top 0.254: JP2.17 24.13,3.17 24.13,5.71 23.82,6.02 TVP7002.45
G6
  Top 0.254: JP2.16 23.32,4.9 TVP7002.44
G7
  Top 0.254: TVP7002.43 22.82,8.21 21.59,6.98 21.59,3.17 JP2.15
GIN
  Top 0.254: C5.1 CN1.2 4.45,37.46 R2.2
GIN_1
  Top 0.254: TVP7002.2 13.76,26.46 13.97,26.67 13.97,27.31 13.34,27.94 13.34,35.56 11.43,37.46 11.43,38.31 C5.2
GIN_2
  Top 0.254: TVP7002.100 14.32,36.96 C14.1
GIN_3
  Top 0.254: TVP7002.98 15.32,31.2 19.05,34.92 C16.1
GIN_4
  Top 0.254: TVP7002.96 16.32,30.29 19.68,33.66 20.95,33.66 21.59,34.29 C18.1
GND  (via drill 0.6)
  Top 0.254: MEGA328_OUT.5 43.58,44.68 v43.8,44.66 | TVP7002.54 26.35,16.46 v26.35,17.78 | 28.28,23.5 TVP7002.68 28.32,23.5 30.48,23.5 30.48,24.46 TVP7002.70 25.71,24.46 25.4,24.77 | 28.28,23.5 27.78,23.5 | 27.78,23.5 TVP7002.67 29.21,22.96 29.21,23.5 28.28,23.5 | 27.78,23.5 25.4,23.5 | TVP7002.72 25.4,25.46 25.4,25.96 | TVP7002.73 25.4,25.96 | 25.4,25.96 25.4,26.04 | VREG3.1 57.47,14.38 v57.47,14.61 | MEGA328_OUT.21 46.67,45.48 v46.67,46.99 | TVP7002.21 13.53,16.96 14.61,15.88 17.46,15.88 v18.1,15.24 | TVP7002.92 18.32,26.67 19.05,26.67 | TVP7002.95 16.82,26.35 16.83,26.35 | 23.5,27.31 23.32,27.31 TVP7002.82 23.32,30.48 23.5,30.48 | TVP7002.91 18.82,26.35 19.37,26.35 arc-90 19.32,26.4 TVP7002.90
  Bottom 0.254: v43.8,44.66 43.18,44.45 | v26.35,17.78 25.4,17.78 25.4,18.42 | v57.47,14.61 57.78,14.61 | v46.67,46.99 47.31,46.99 | v18.1,15.24 18.1,14.92
  other vias: 60.64,39.37 58.74,45.09 9.21,21.27 8.26,14.29 16.51,26.67 23.5,22.54 10.16,40 10.16,37.46 10.16,34.92 21.59,8.89 66.67,29.85 27.94,38.73 24,19.69 2.54,14.35 1.52,54.23
  pour Bottom: 71.91,0.64 0,0.64 0,59.69 71.91,59.69
  pour Top: 0,59.69 71.91,59.69 72.04,0.13 0.13,0.13
HSOUT  (via drill 0.6)
  Top 0.254: JP4.7 10.48,53.02 10.48,45.09 9.21,43.81 v8.89,43.81 | v2.86,31.43 2.86,18.1 5.5,15.46 TVP7002.24
  Bottom 0.254: v8.89,43.81 7.62,42.54 1.91,42.54 0.95,41.59 0.95,33.34 v2.86,31.43
N$2
  Top 0.254: J2.2 54.26,31.47 46.99,38.73 46.99,40.72 MEGA328_OUT.14
N$3
  Top 0.254: MEGA328_OUT.9 42.92,38.98 LED1.+
N$4
  Top 0.254: MEGA328_CTRL.7 47.72,8.98 46.35,7.62 Y2.1 C39.1
N$5
  Top 0.254: C36.1 51.22,7.62 Y2.2 48.52,8.25 MEGA328_CTRL.8
N$6
  Top 0.254: MEGA328_OUT.10 43.72,36.93 LED2.+
N$7
  Top 0.254: MEGA328_OUT.11 44.52,34.87 LED3.+
N$8
  Top 0.254: R5.1 DONE.+
N$9
  Top 0.254: MEGA328_OUT.12 45.32,32.81 LED4.+
N$10
  Top 0.254: Y1.1 37.94,46.52 | 37.94,46.52 40.01,44.45 40.01,43.18 41.33,43.18 MEGA328_OUT.7 | 37.94,46.52 35.02,46.52 C30.1
N$11
  Top 0.254: MEGA328_OUT.8 38.27,42.28 Y1.2 35.11,42.62 C29.1
N$12
  Top 0.254: LED1.- R10.1
N$13
  Top 0.254: LED2.- R11.1
N$14
  Top 0.254: LED3.- R12.1
N$15
  Top 0.254: LED4.- 37.47,28.89 R13.1 37.15,28.89
N$16
  Top 0.254: MEGA328_CTRL.22 44.52,20.39 45.72,21.59 46.99,21.59 47.62,22.23 47.62,24.13 48.9,25.4 LED5.+
N$17
  Top 0.254: LED5.- R14.1
N$28  (via drill 0.6)
  Top 0.254: TVP7002.88 20.32,31.12 v20.95,31.75
  Bottom 0.254: v20.95,31.75 20.95,34.71 C21.2
N$29  (via drill 0.6)
  Top 0.254: TVP7002.87 20.82,30.03 21.27,30.48 21.91,30.48 v22.54,31.12
  Bottom 0.254: v22.54,31.12 22.86,31.43 R6.1
N$34
  Bottom 0.254: R6.2 22.86,37.46 21.59,38.73 19.47,38.73 C22.2
N$35  (via drill 0.6)
  Top 0.254: TVP7002.89 19.82,30.98 v19.37,31.43
  Bottom 0.254: v19.37,31.43 17.78,33.02 C22.1 18.2,35.34 19.05,36.2 19.47,36.2 C21.1
PCLK
  Top 0.254: TVP7002.28 15.32,14.53 15.24,14.61 13.97,14.61 12.7,13.33 6.35,13.33 1.27,18.42 1.27,47.62 1.65,48.01 9.27,48.01 9.27,53.21 10.16,54.1 JP4.5 10.16,53.98
R0
  Top 0.254: JP2.30 40.64,5.08 38.73,6.98 37.47,6.98 34.29,10.16 34.29,16.51 29.84,20.96 TVP7002.63
R1
  Top 0.254: JP2.29 39.37,3.17 39.37,5.71 38.73,6.35 37.47,6.35 33.66,10.16 33.66,16.51 29.71,20.46 TVP7002.62
R2
  Top 0.254: JP2.28 38.1,5.08 33.02,10.16 33.02,16.51 29.57,19.96 TVP7002.61
R3
  Top 0.254: JP2.27 36.83,3.17 36.83,5.71 36.2,6.35 34.92,6.35 32.38,8.89 32.38,16.51 29.94,18.96 TVP7002.59
R4
  Top 0.254: JP2.26 35.56,5.08 31.75,8.89 31.75,16.51 29.8,18.46 TVP7002.58
R5
  Top 0.254: JP2.25 34.29,3.17 34.29,5.71 31.11,8.89 31.11,16.51 29.67,17.96 TVP7002.57
R6
  Top 0.254: JP2.24 32.38,5.08 32.38,6.98 30.48,8.89 30.48,16.51 29.54,17.46 TVP7002.56
R7
  Top 0.254: JP2.23 31.75,3.17 31.75,6.98 29.84,8.89 29.84,16.51 29.4,16.96 TVP7002.55
RESET  (via drill 0.6)
  Top 0.254: v39.37,17.15 R9.2 37.78,17.25 v37.78,20.32 38.1,20.32 39.37,21.59 39.37,24.13 40.01,24.77 41.91,24.77 I2C.3 | v47.62,17.15 47.62,16.51 48.26,15.88 49.94,15.88 MEGA328_CTRL.14 | TVP7002.71 33.15,24.96 v35.24,22.86
  Bottom 0.254: v39.37,17.15 v47.62,17.15 48.26,17.15 | v35.24,22.86 v37.78,20.32
RIN
  Top 0.254: C11.1 CN1.1 4.45,40 R4.2
RIN_1  (via drill 0.6)
  Top 0.254: C11.2 12.7,39.59 v12.7,38.1 | v8.89,29.85 8.89,23.5 10.43,21.96 TVP7002.11
  Bottom 0.254: v12.7,38.1 12.7,32.38 10.79,30.48 9.53,30.48 v8.89,29.85
RIN_2  (via drill 0.6)
  Top 0.254: v14.61,22.23 14.38,22.46 TVP7002.10
  Bottom 0.254: C9.1 v14.61,22.23
RIN_3
  Top 0.254: TVP7002.9 10.7,22.96 10.16,23.5 C10.1
SCL  (via drill 0.6)
  Top 0.254: R8.2 38.1,12.06 39.37,13.33 v39.37,14.61 39.77,15 MEGA328_CTRL.28 | TVP7002.74 33.55,26.46 36.51,23.5 v37.78,23.5 40.32,26.04 I2C.2
  Bottom 0.254: v37.78,23.5 39.37,21.91 39.37,19.69 38.1,18.42 38.1,15.88 v39.37,14.61
SDA  (via drill 0.6)
  Top 0.254: R7.2 38.88,15.8 40.32,15.8 | 40.32,15.8 MEGA328_CTRL.27 41.5,15.88 v43.18,15.88 | TVP7002.75 29.3,27.94 v30.48,27.94 | v32.7,23.5 34.61,21.59 v34.61,21.27 | 40.32,15.8 40.32,23.18 I2C.1
  Bottom 0.254: v30.48,27.94 32.7,25.72 v32.7,23.5 | v34.61,21.27 34.61,17.46 38.73,13.33 40.64,13.33 v43.18,15.88
SOGIN_1
  Top 0.254: TVP7002.1 11.01,28.27 C8.2
SOGIN_2
  Top 0.254: TVP7002.99 14.82,33.23 16.93,35.34 C17.1
SOGIN_3
  Top 0.254: TVP7002.97 15.82,30.85 C15.1
UNUSED1  (via drill 0.6)
  Top 0.254: MEGA328_OUT.30 44.52,50.73 41.59,53.66 36.2,53.66 v35.56,53.02
  Bottom 0.254: v35.56,53.02 27.62,53.02 JP4.17
UNUSED2  (via drill 0.6)
  Top 0.254: MEGA328_OUT.31 43.72,50.58 41.27,53.02 37.78,53.02 v36.2,51.43
  Bottom 0.254: v36.2,51.43 26.67,51.43 JP4.15
VSOUT  (via drill 0.6)
  Top 0.254: TVP7002.23 5.95,15.96 3.49,18.42 3.49,23.5 4.13,24.13 v4.13,29.53 | v10.79,43.18 11.43,43.81 11.43,51.75 14.92,55.24 JP4.9
  Bottom 0.254: v4.13,29.53 4.13,30.16 5.08,31.12 5.08,37.46 v10.79,43.18
W_MISO  (via drill 0.6)
  Top 0.254: J2.7 54.67,25.97 53.98,26.67 v53.98,30.48 | v52.7,35.56 48.52,39.74 MEGA328_OUT.16 | ISP_OUT.1 58.42,50.16 v57.78,49.53
  Bottom 0.254: v53.98,30.48 53.98,34.29 v52.7,35.56 57.78,40.64 v57.78,49.53
W_MOSI  (via drill 0.6)
  Top 0.254: J2.3 57.67,30.37 58.42,31.12 58.42,33.02 57.15,34.29 52.7,34.29 47.72,39.27 MEGA328_OUT.15 47.62,40.89 v47.62,42.54 | ISP_OUT.4 67.31,46.35 67.31,42.54 v66.04,41.27 | v62.23,41.27 55.88,41.27 v54.61,40
  Bottom 0.254: v66.04,41.27 v62.23,41.27 | v54.61,40 50.16,40 v47.62,42.54
W_RST  (via drill 0.6)
  Top 0.254: v46.99,52.7 45.32,51.03 MEGA328_OUT.29
  Bottom 0.254: ISP_OUT.5 58.42,52.7 v46.99,52.7
W_SCK
  Top 0.254: 59.05,34.92 54.61,34.92 50.8,38.73 50.8,41.5 MEGA328_OUT.17 | J2.5 58.65,28.17 60.33,29.85 60.33,33.66 59.05,34.92 | ISP_OUT.3 65.41,47.62 64.14,46.35 64.14,40 59.05,34.92
W_VCC  (via drill 0.6)
  Top 0.254: J2.4 57.73,29.27 v57.78,29.21 | VREG4.4 VREG4.2 | 52.07,45.09 51.67,44.68 MEGA328_OUT.20 45.32,44.68 45.09,44.45 | 54.61,47.62 54.85,47.62 VREG4.2 | MEGA328_OUT.18 51.34,43.09 52.06,43.81 | 52.07,45.09 52.07,43.81 52.06,43.81 | VREG4.4 62.08,47.48 63.5,48.89 67.31,48.89 ISP_OUT.2 | VREG4.4 60.74,47.02 C34.1 60.33,43.81 v59.05,42.54 | C35.1 52.06,43.81 | 45.09,44.45 45.09,45.09 44.69,45.48 MEGA328_OUT.4 40.24,45.48 40.01,45.72 40.01,48.84 C32.1 | 45.09,44.45 44.45,43.81 41.5,43.81 MEGA328_OUT.6 | 52.07,45.09 52.07,47.48 VREG4.2
  Bottom 0.254: v57.78,29.21 58.26,29.68 C31.1 59.47,30.89 59.69,31.12 59.69,33.66 59.05,34.29 v59.05,42.54

### Text on the board
tPlace: R | G | B | S | JAMMAGrabber / buffi 2015 / github.com/buffis